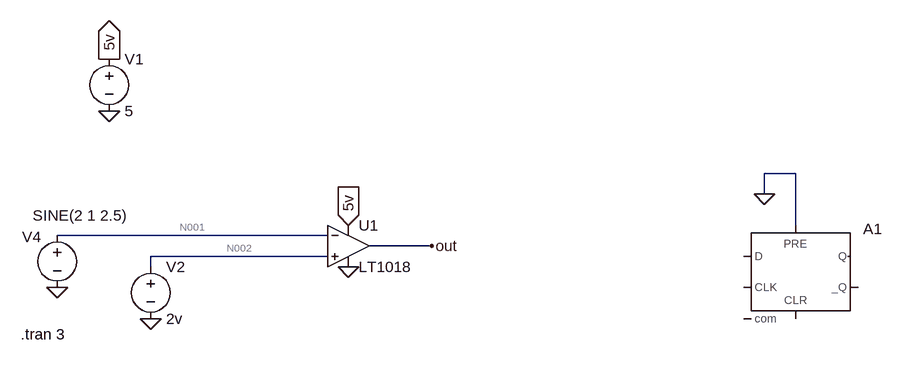
[diagram p0: schematic Draft1.asc]
Draft1.asc, the LTspice schematic file:
Version 4
SHEET 1 880 680
WIRE 480 -144 432 -144
WIRE 432 -112 432 -144
WIRE 480 -64 480 -144
WIRE -240 -48 -656 -48
WIRE -80 -32 -176 -32
WIRE -240 -16 -512 -16
WIRE -512 0 -512 -16
FLAG 432 -112 0
FLAG -208 0 0
FLAG -576 -240 0
FLAG -576 -320 5v
IOPIN -576 -320 Out
FLAG -208 -64 5v
IOPIN -208 -64 In
FLAG -512 80 0
FLAG -656 32 0
FLAG -80 -32 out
SYMBOL Comparators\\LT1018 -208 -32 R0
SYMATTR InstName U1
SYMBOL Digital\\dflop 480 -64 R0
SYMATTR InstName A1
SYMBOL voltage -576 -336 R0
WINDOW 123 0 0 Left 0
WINDOW 39 0 0 Left 0
SYMATTR InstName V1
SYMATTR Value 5
SYMBOL voltage -512 -16 R0
WINDOW 123 0 0 Left 0
WINDOW 39 0 0 Left 0
SYMATTR InstName V2
SYMATTR Value 2v
SYMBOL voltage -656 -64 R0
WINDOW 0 -54 18 Left 2
WINDOW 3 -38 -15 Left 2
WINDOW 123 0 0 Left 0
WINDOW 39 0 0 Left 0
SYMATTR InstName V4
SYMATTR Value SINE(2 1 2.5)
TEXT -712 104 Left 2 !.tran 3

The netlist it stands for:
* Draft1.asc
XU1 N002 N001 5v 0 out LT1018  ; pins In+ In- V+ V- OUT
A1 0 0 0 0 0 0 0 0 DFLOP
V1 5v 0 5
V2 N002 0 2v
V4 N001 0 SINE(2 1 2.5)
.tran 3
.lib LTC1.lib
.backanno
.end

* Results of the author's LTspice run, read from the files saved beside the schematic
* Operating Point, zero values left out:
*   V(5v) = 5 V
*   V(out) = 22.12 mV
*   V(n001) = 2 V
*   V(n002) = 2 V
*   I(V4) = -3.1 nA
*   I(V2) = -3.1 nA
*   I(V1) = -161.9 µA
*   Ix(u1:1) = 3.1 nA
*   Ix(u1:2) = 3.1 nA
*   Ix(u1:3) = 161.9 µA
*   Ix(u1:4) = -161.9 µA
*   Ix(u1:5) = 4.938 pA
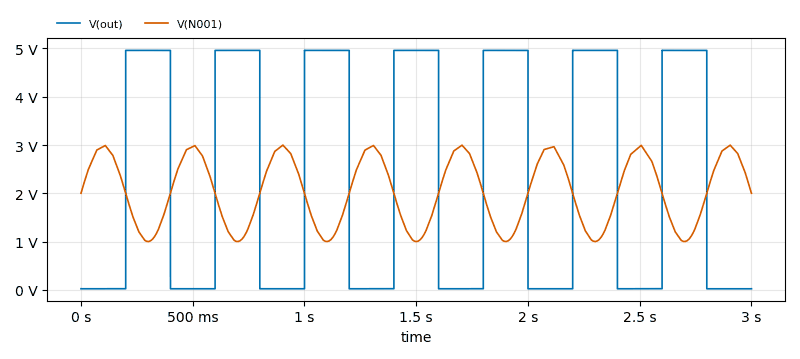
[diagram p1: Transient Analysis of Draft1.asc, plotted from the saved traces]
* Transient Analysis, 1 run:
*   V(out): min 21.42 mV, max 4.961 V, average 2.327 V, rms 3.389 V, last 21.95 mV
*   V(N001): min 1 V, max 2.998 V, average 2.036 V, rms 2.153 V, last 2 V